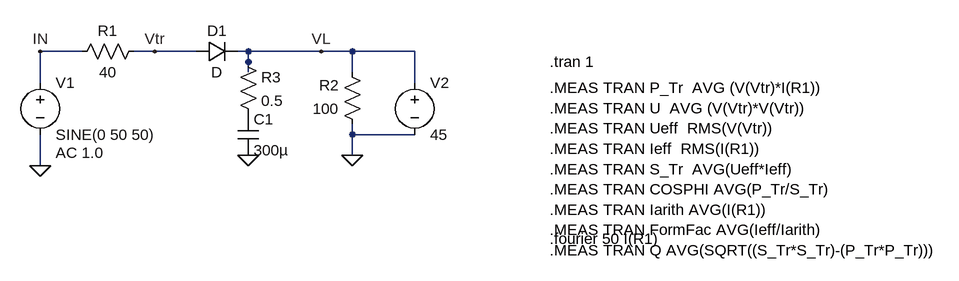
[diagram p0: schematic SingleDiodeGrC.asc]
SingleDiodeGrC.asc, the LTspice schematic file:
Version 4
SHEET 1 1124 680
WIRE -304 240 -368 240
WIRE -192 240 -224 240
WIRE -128 240 -192 240
WIRE -48 240 -64 240
WIRE 64 240 -48 240
WIRE 112 240 64 240
WIRE 208 240 112 240
WIRE -48 256 -48 240
WIRE -48 272 -48 256
WIRE 112 272 112 240
WIRE -368 288 -368 240
WIRE 208 288 208 240
WIRE 112 368 112 352
WIRE 208 368 112 368
WIRE 112 400 112 368
WIRE -368 416 -368 368
FLAG -368 416 0
FLAG -368 240 IN
FLAG 112 400 0
FLAG -192 240 Vtr
FLAG 64 240 VL
FLAG -48 400 0
SYMBOL voltage -368 272 R0
WINDOW 123 24 124 Left 2
WINDOW 39 0 0 Left 2
SYMATTR Value2 AC 1.0
SYMATTR InstName V1
SYMATTR Value SINE(0 50 50)
SYMBOL res -208 224 R90
WINDOW 0 0 56 VBottom 2
WINDOW 3 32 56 VTop 2
SYMATTR InstName R1
SYMATTR Value 40
SYMBOL diode -128 256 R270
WINDOW 0 32 32 VTop 2
WINDOW 3 0 32 VBottom 2
SYMATTR InstName D1
SYMBOL res 128 368 R180
WINDOW 0 36 76 Left 2
WINDOW 3 36 40 Left 2
SYMATTR InstName R2
SYMATTR Value 100
SYMBOL cap -64 336 R0
SYMATTR InstName C1
SYMATTR Value 300µ
SYMBOL res -64 240 R0
SYMATTR InstName R3
SYMATTR Value 0.5
SYMBOL voltage 208 272 R0
WINDOW 123 24 124 Left 2
WINDOW 39 0 0 Left 2
SYMATTR InstName V2
SYMATTR Value 45
TEXT 416 296 Left 2 !.MEAS TRAN P_Tr  AVG (V(Vtr)*I(R1))\n.MEAS TRAN U  AVG (V(Vtr)*V(Vtr))\n.MEAS TRAN Ueff  RMS(V(Vtr))\n.MEAS TRAN Ieff  RMS(I(R1))\n.MEAS TRAN S_Tr  AVG(Ueff*Ieff)\n.MEAS TRAN COSPHI AVG(P_Tr/S_Tr)\n.MEAS TRAN Iarith AVG(I(R1))\n.MEAS TRAN FormFac AVG(Ieff/Iarith)\n.MEAS TRAN Q AVG(SQRT((S_Tr*S_Tr)-(P_Tr*P_Tr)))
TEXT 416 256 Left 2 !.tran 1
TEXT 416 528 Left 2 !.fourier 50 I(R1)

The netlist it stands for:
* SingleDiodeGrC.asc
V1 IN 0 SINE(0 50 50) AC 1.0
R1 Vtr IN 40
D1 Vtr VL D
R2 0 VL 100
C1 P001 0 300µ
R3 VL P001 0.5
V2 VL 0 45
.model D D
.lib standard.dio
.MEAS TRAN P_Tr  AVG (V(Vtr)*I(R1))
.MEAS TRAN U  AVG (V(Vtr)*V(Vtr))
.MEAS TRAN Ueff  RMS(V(Vtr))
.MEAS TRAN Ieff  RMS(I(R1))
.MEAS TRAN S_Tr  AVG(Ueff*Ieff)
.MEAS TRAN COSPHI AVG(P_Tr/S_Tr)
.MEAS TRAN Iarith AVG(I(R1))
.MEAS TRAN FormFac AVG(Ieff/Iarith)
.MEAS TRAN Q AVG(SQRT((S_Tr*S_Tr)-(P_Tr*P_Tr)))
.tran 1
.fourier 50 I(R1)
.backanno
.end

* Results of the author's LTspice run, read from the files saved beside the schematic
* Operating Point, zero values left out:
*   V(vl) = 45 V
*   V(p001) = 45 V
*   I(D1) = -45.01 pA
*   I(R2) = -450 mA
*   I(R1) = 45.01 pA
*   I(V2) = -450 mA
*   I(V1) = 45.01 pA
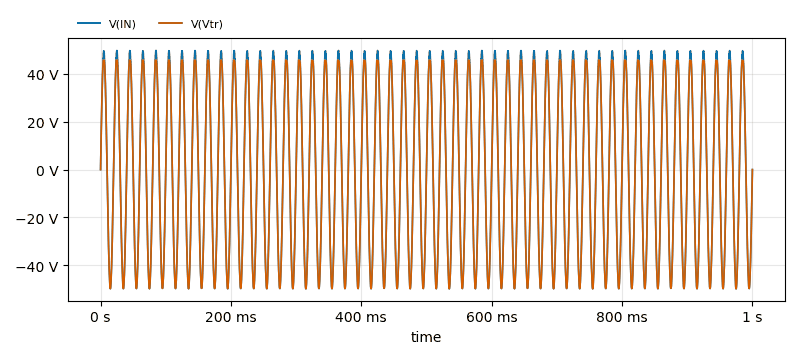
[diagram p1: Transient Analysis of SingleDiodeGrC.asc, plotted from the saved traces]
* Transient Analysis, 1 run:
*   V(IN): min -49.88 V, max 49.88 V, average 10.38 mV, rms 34.98 V, last 0 V
*   V(Vtr): min -49.88 V, max 45.77 V, average -414.5 mV, rms 34.41 V, last 0 V
* From the log:
*   N-Period=1
*   Fourier components of I(r1)
*   DC component:-0.0107509
*   Harmonic  Frequency   Fourier   Normalized   Phase    Normalized
*    Number     [Hz]     Component   Component  [degree]  Phase [deg]
*       1     5.000e+01  2.072e-02  1.000e+00   -179.53°      0.00°
*       2     1.000e+02  1.852e-02  8.939e-01     90.90°    270.43°
*       3     1.500e+02  1.534e-02  7.405e-01      1.27°    180.80°
*       4     2.000e+02  1.176e-02  5.675e-01    -88.45°     91.09°
*       5     2.500e+02  8.331e-03  4.021e-01   -178.24°      1.29°
*       6     3.000e+02  5.480e-03  2.645e-01     91.99°    271.52°
*       7     3.500e+02  3.395e-03  1.639e-01      2.53°    182.06°
*       8     4.000e+02  2.048e-03  9.887e-02    -86.06°     93.47°
*       9     4.500e+02  1.262e-03  6.090e-02   -173.36°      6.18°
*   Total Harmonic Distortion: 139.338405%(139.468586%)
*   p_tr: AVG(v(vtr)*i(r1))=-0.477092 FROM 0 TO 1
*   u: AVG(v(vtr)*v(vtr))=1165.84 FROM 0 TO 1
*   ueff: RMS(v(vtr))=34.1444 FROM 0 TO 1
*   ieff: RMS(i(r1))=0.0271402 FROM 0 TO 1
*   s_tr: AVG(ueff*ieff)=0.926687 FROM 0 TO 1
*   cosphi: AVG(p_tr/s_tr)=-0.514837 FROM 0 TO 1
*   iarith: AVG(i(r1))=-0.010622 FROM 0 TO 1
*   formfac: AVG(ieff/iarith)=-2.5551 FROM 0 TO 1
*   q: AVG(sqrt((s_tr*s_tr)-(p_tr*p_tr)))=0.794438 FROM 0 TO 1